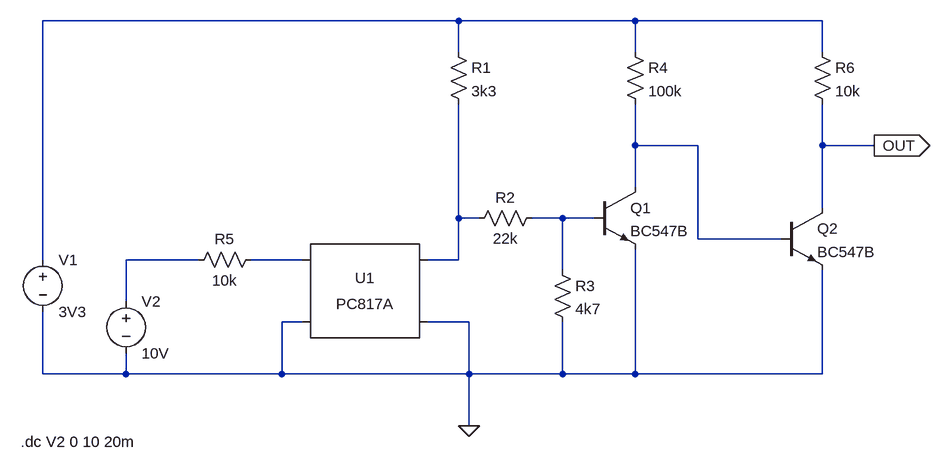
[diagram p0: schematic Draft1.asc]
Draft1.asc, the LTspice schematic file:
Version 4
SHEET 1 1084 680
WIRE 336 -272 -304 -272
WIRE 608 -272 336 -272
WIRE 896 -272 608 -272
WIRE 336 -224 336 -272
WIRE 608 -224 608 -272
WIRE 896 -224 896 -272
WIRE 608 -80 608 -144
WIRE 704 -80 608 -80
WIRE 896 -80 896 -144
WIRE 976 -80 896 -80
WIRE 608 -16 608 -80
WIRE 896 16 896 -80
WIRE 336 32 336 -144
WIRE 368 32 336 32
WIRE 496 32 448 32
WIRE 544 32 496 32
WIRE 704 64 704 -80
WIRE 832 64 704 64
WIRE -304 96 -304 -272
WIRE -64 96 -176 96
WIRE 96 96 16 96
WIRE 336 96 336 32
WIRE 336 96 288 96
WIRE 496 112 496 32
WIRE -176 160 -176 96
WIRE 96 192 64 192
WIRE 352 192 288 192
WIRE -304 272 -304 176
WIRE -176 272 -176 240
WIRE -176 272 -304 272
WIRE 64 272 64 192
WIRE 64 272 -176 272
WIRE 352 272 352 192
WIRE 352 272 64 272
WIRE 496 272 496 192
WIRE 496 272 352 272
WIRE 608 272 608 80
WIRE 608 272 496 272
WIRE 896 272 896 112
WIRE 896 272 608 272
WIRE 352 352 352 272
FLAG 352 352 0
FLAG 976 -80 OUT
IOPIN 976 -80 Out
SYMBOL Optos\\PC817A 192 144 R0
SYMATTR InstName U1
SYMBOL npn 544 -16 R0
SYMATTR InstName Q1
SYMATTR Value BC547B
SYMBOL res 320 -240 R0
SYMATTR InstName R1
SYMATTR Value 3k3
SYMBOL res 464 16 R90
WINDOW 0 0 56 VBottom 2
WINDOW 3 32 56 VTop 2
SYMATTR InstName R2
SYMATTR Value 22k
SYMBOL res 480 96 R0
SYMATTR InstName R3
SYMATTR Value 4k7
SYMBOL res 592 -240 R0
SYMATTR InstName R4
SYMATTR Value 100k
SYMBOL voltage -304 80 R0
SYMATTR InstName V1
SYMATTR Value 3V3
SYMBOL voltage -176 144 R0
SYMATTR InstName V2
SYMATTR Value 10V
SYMBOL res 32 80 R90
WINDOW 0 0 56 VBottom 2
WINDOW 3 32 56 VTop 2
SYMATTR InstName R5
SYMATTR Value 10k
SYMBOL npn 832 16 R0
SYMATTR InstName Q2
SYMATTR Value BC547B
SYMBOL res 880 -240 R0
SYMATTR InstName R6
SYMATTR Value 10k
TEXT -338 376 Left 2 !.dc V2 0 10 20m

The netlist it stands for:
* Draft1.asc
XU1 N006 0 N003 0 PC817 Igain=1m
Q1 N002 N004 0 0 BC547B
R1 N001 N003 3k3
R2 N004 N003 22k
R3 N004 0 4k7
R4 N001 N002 100k
V1 N001 0 3V3
V2 N005 0 10V
R5 N006 N005 10k
Q2 OUT N002 0 0 BC547B
R6 N001 OUT 10k
.model NPN NPN
.model PNP PNP
.lib standard.bjt
.dc V2 0 10 20m
.lib PC817.sub
.backanno
.end